# EAGLE schematic relay_din_secondary_board (EAGLE 6.4)
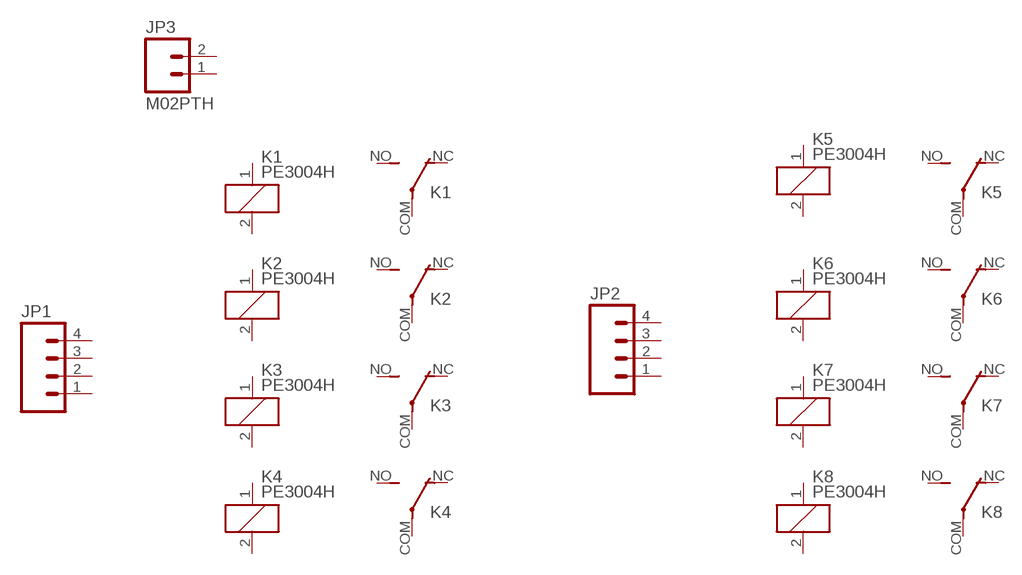
[diagram p0: schematic, sheet 1]

## Parts
JP1  M04PTH  [1X04]
JP2  M04PTH  [1X04]
JP3  M02PTH  [1X02]
K1  PE3004H  [PE-FORM-C]
K2  PE3004H  [PE-FORM-C]
K3  PE3004H  [PE-FORM-C]
K4  PE3004H  [PE-FORM-C]
K5  PE3004H  [PE-FORM-C]
K6  PE3004H  [PE-FORM-C]
K7  PE3004H  [PE-FORM-C]
K8  PE3004H  [PE-FORM-C]
Unconnected: JP1.1 JP1.2 JP1.3 JP1.4 JP2.1 JP2.2 JP2.3 JP2.4 JP3.1 JP3.2 K1.1 K1.2 K1.COM(2:P) K1.NC(2:O) K1.NO(2:S) K2.1 K2.2 K2.COM(2:P) K2.NC(2:O) K2.NO(2:S) K3.1 K3.2 K3.COM(2:P) K3.NC(2:O) K3.NO(2:S) K4.1 K4.2 K4.COM(2:P) K4.NC(2:O) K4.NO(2:S) K5.1 K5.2 K5.COM(2:P) K5.NC(2:O) K5.NO(2:S) K6.1 K6.2 K6.COM(2:P) K6.NC(2:O) K6.NO(2:S) K7.1 K7.2 K7.COM(2:P) K7.NC(2:O) K7.NO(2:S) K8.1 K8.2 K8.COM(2:P) K8.NC(2:O) K8.NO(2:S)

## Library data of the parts
JP1 JP2 = SparkFun-Connectors:M04: Header 4 Standard 4-pin 0.1" header. Use with straight break away headers (SKU : PRT-00116), right angle break away headers (PRT-00553), swiss pins (PRT-00743), machine pins (PRT-00117), and female headers (PRT-00115). Molex polarized connector foot print use with SKU : PRT-08231 with associated crimp pins and housings. 1MM SMD Version SKU: PRT-10208
JP3 = SparkFun-Connectors:M02: Standard 2-pin 0.1" header. Use with - straight break away headers ( PRT-00116) - right angle break away headers (PRT-00553) - swiss pins (PRT-00743) - machine pins (PRT-00117) - female headers (PRT-00115) Molex polarized connector foot print use with: PRT-08233 with associated crimp pins and housings. 2.54_SCREWTERM for use with PRT-10571. 3.5mm Screw Terminal footprints for PRT-08084 5mm Screw Terminal footprints for use with PRT-08433
K1-K8 = relay:PE30?*: SLIM POWER Relay NAiS Source: http://www.mew-europe.com/.. en_ds_61122_0000.pdf; MPN: APE3004H; OC_FARNELL: unknown; OC_NEWARK: 55M0343